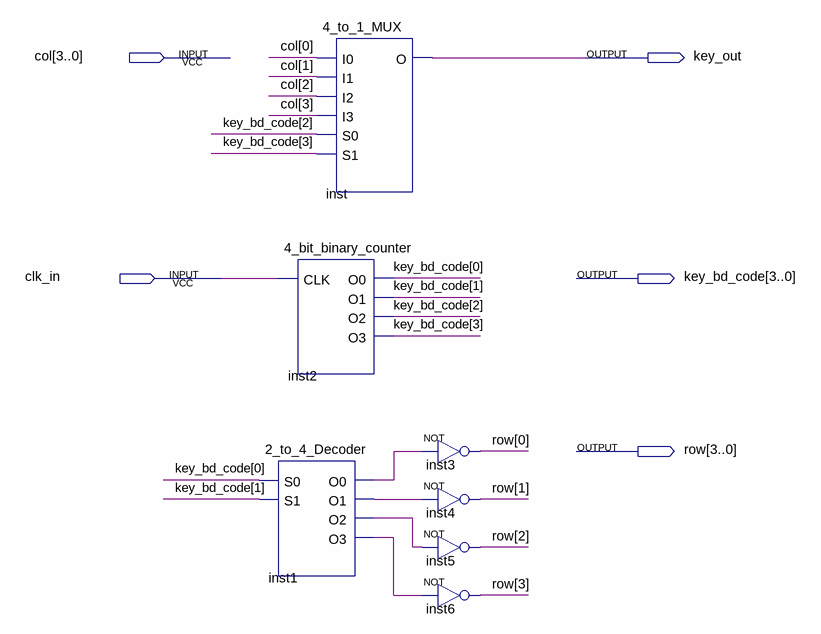
[diagram p0: schematic sheet]
// Quartus schematic key_scan.bdf as structural Verilog: 7 symbols, 5 pins
module key_scan (
  input  [3:0] col,
  input  clk_in,
  output key_out,
  output [3:0] key_bd_code,
  output [3:0] row
);

  wire inst1_o0, inst1_o1, inst1_o2, inst1_o3;

  \2_to_4_Decoder  inst1 (
    .S0(key_bd_code[0]), .S1(key_bd_code[1]), .O0(inst1_o0), .O1(inst1_o1), .O2(inst1_o2), .O3(inst1_o3));
  \4_to_1_MUX  inst (
    .I0(col[0]), .I1(col[1]), .I2(col[2]), .I3(col[3]), .S0(key_bd_code[2]), .S1(key_bd_code[3]), .O(key_out));
  \4_bit_binary_counter  inst2 (
    .CLK(clk_in), .O0(key_bd_code[0]), .O1(key_bd_code[1]), .O2(key_bd_code[2]), .O3(key_bd_code[3]));
  not inst3 (row[0], inst1_o0);
  not inst4 (row[1], inst1_o1);
  not inst5 (row[2], inst1_o2);
  not inst6 (row[3], inst1_o3);
endmodule
